# EAGLE design temprature control (EAGLE 9.6.2)
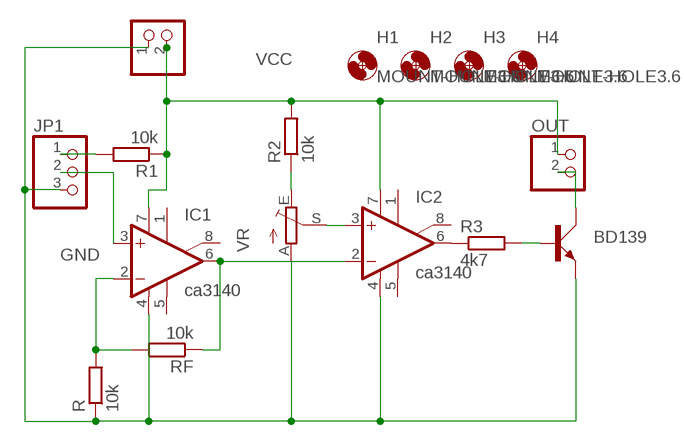
[diagram p0: schematic, sheet 1]

## Parts
H1  MOUNT-HOLE3.6  [3,6]
H2  MOUNT-HOLE3.6  [3,6]
H3  MOUNT-HOLE3.6  [3,6]
H4  MOUNT-HOLE3.6  [3,6]
IC1  ca3140  LM3080N  [DIL08]
IC2  ca3140  LM3080N  [DIL08]
JP1  PINHD-1X3  [1X03]
OUT  PINHD-1X2  [1X02]
Q1  BD139  [TO126AV]
R  10k  R-EU_0207/15  [0207/15]
R1  10k  R-EU_0207/15  [0207/15]
R2  10k  R-EU_0207/15  [0207/15]
R3  4k7  R-EU_0207/15  [0207/15]
RF  10k  R-EU_0207/15  [0207/15]
VCC  PINHD-1X2  [1X02]
VR  TRIM_EU-LI10  [LI10]

## Nets
GND: IC1.4(V-) IC2.4(V-) JP1.3 Q1.E R.1 VCC.1 VR.A
N$1: Q1.B R3.2
N$2: IC1.3(+IN) JP1.2
N$3: OUT.2 Q1.C
N$4: JP1.1 R1.2
N$5: IC1.2(-IN) R.2 RF.2
N$6: IC1.6(OUT) IC2.2(-IN) RF.1
N$7: IC2.6(OUT) R3.1
N$8: R2.1 VR.E
N$9: IC2.3(+IN) VR.S
VCC: IC1.7(V+) IC2.7(V+) OUT.1 R1.1 R2.2 VCC.2
Unconnected: IC1.1(ON1) IC1.5(OPT) IC1.8(ON2) IC2.1(ON1) IC2.5(OPT) IC2.8(ON2)

## Library data of the parts
H1-H4 = holes:MOUNT-HOLE: MOUNTING HOLE with drill center marker
IC1 IC2 = linear 2:*3080: OP AMP
JP1 = pinhead 2:PINHD-1X3: PIN HEADER
OUT VCC = pinhead 2:PINHD-1X2: PIN HEADER
Q1 = transistor-power 2:BD139: NPN TRANSISTOR
R R1-R3 RF = rcl:R-EU_: RESISTOR, European symbol; SPICEPREFIX: R
VR = pot2:TRIM_EU-: POTENTIOMETER

## Board
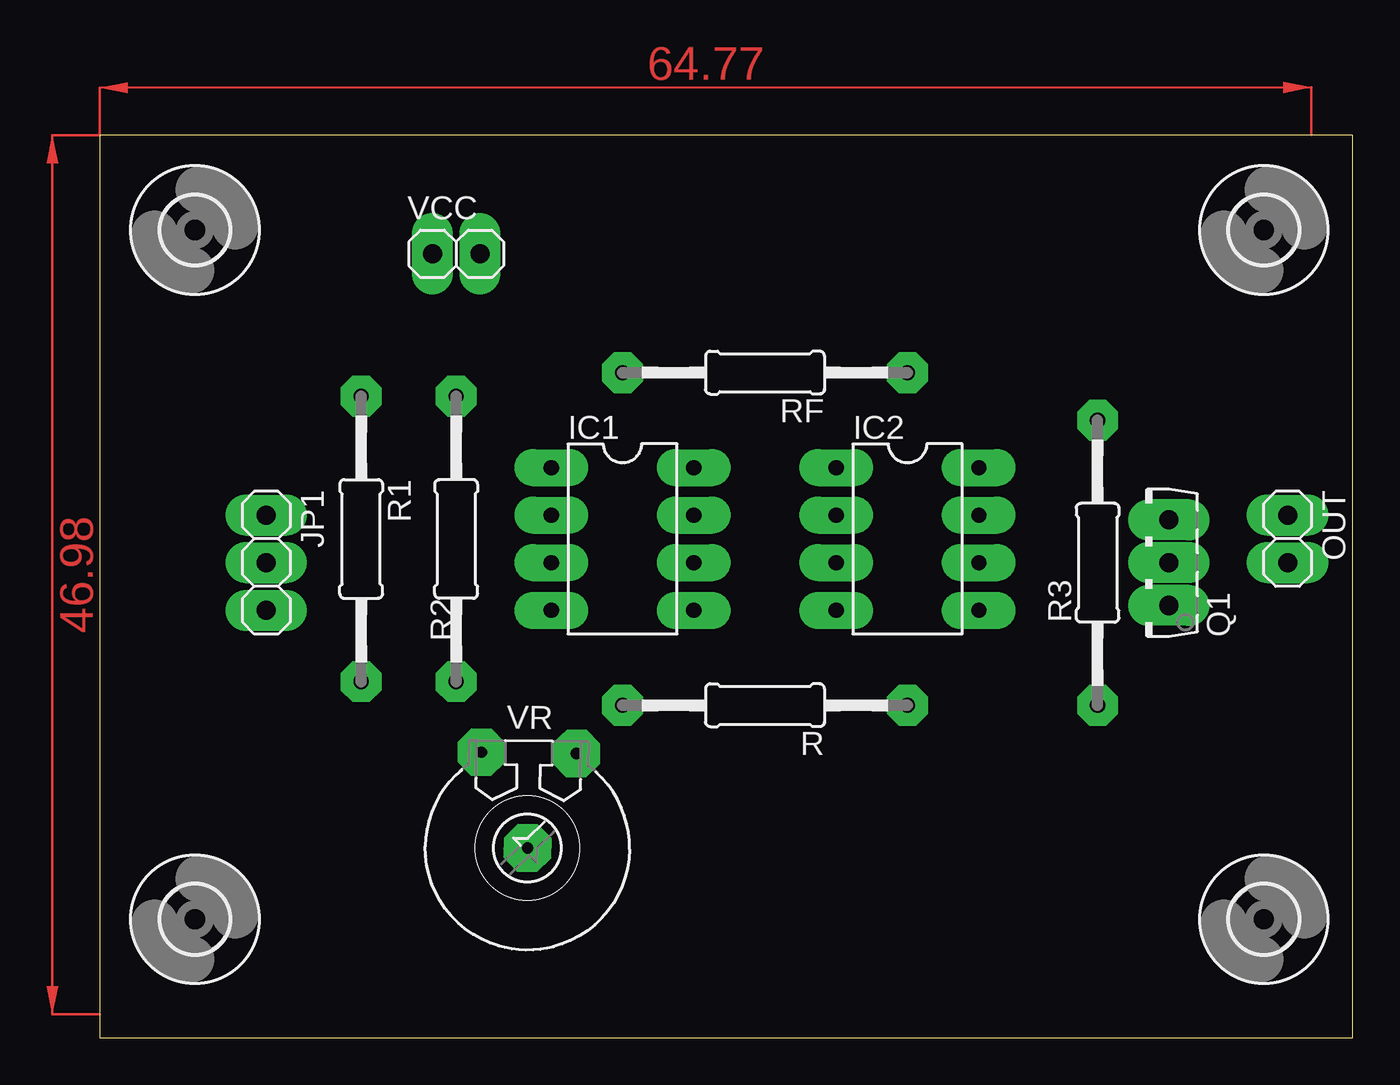
[diagram p1: board, top side]
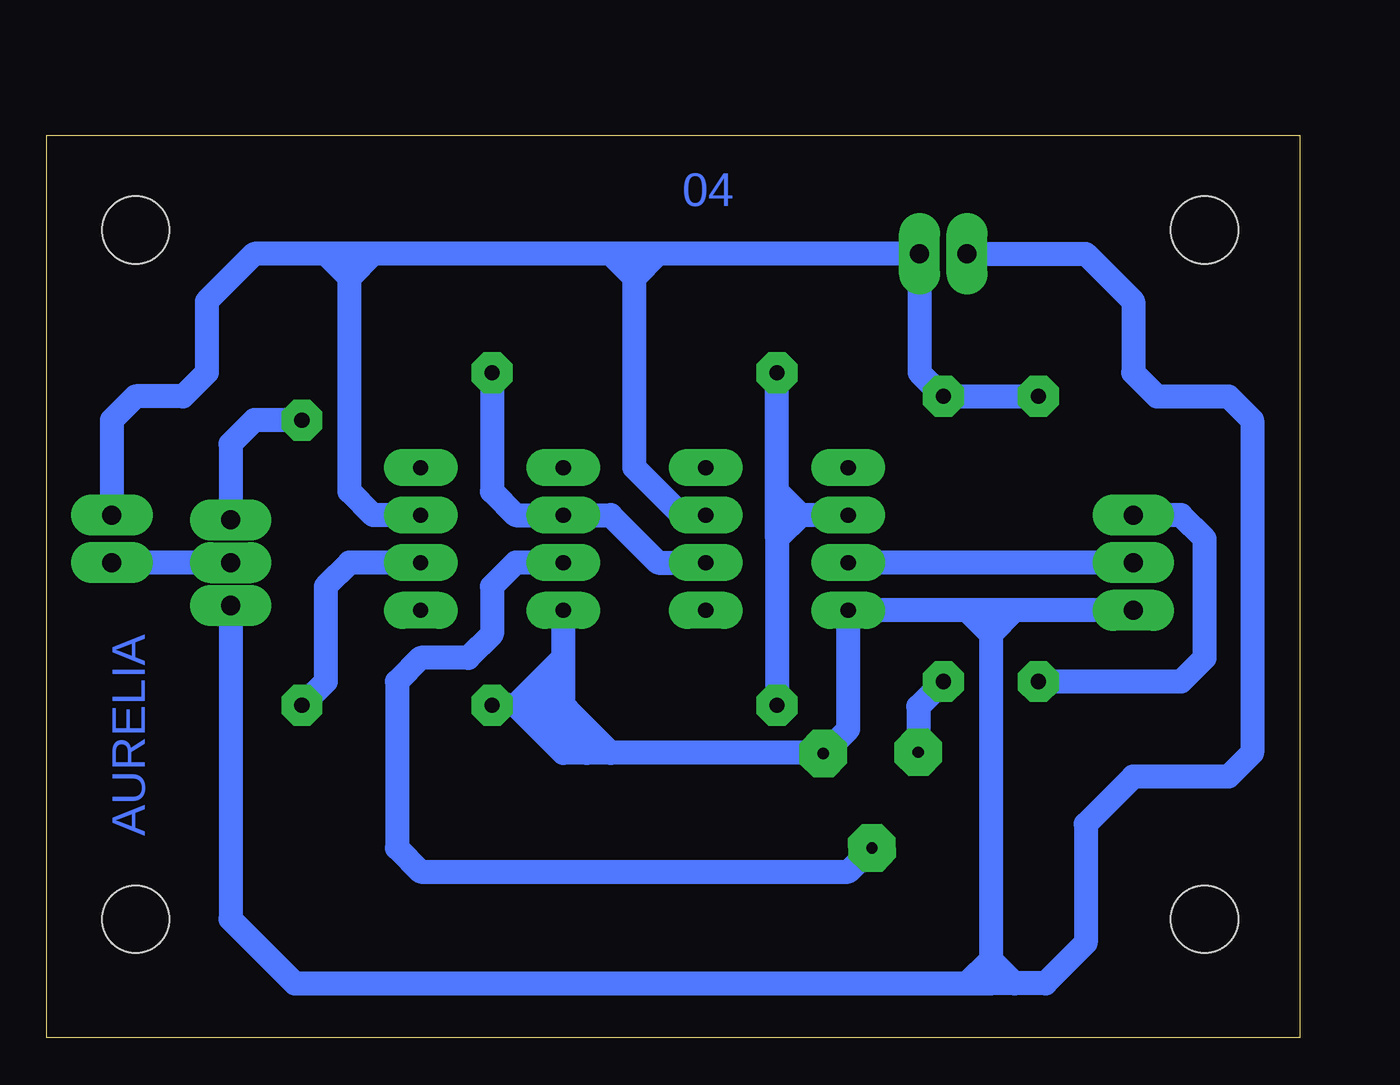
[diagram p2: board, bottom side, seen from below]

Size 66.98 x 48.25 mm. Coordinates in mm from the lower left corner, seen from the top.
Outline: 0,0 66.98,0 66.98,48.25 0,48.25 0,0
Copper layers (1*16): Top 0.035mm / dielectric 1.5mm / Bottom 0.035mm
Design rules "default *": minimum track width 6mil, minimum drill 0.35mm, track to track 6mil, track to pad 6mil, pad to pad 6mil, via to via 6mil, smd to smd 6mil, copper to edge 40mil, drill to drill 6mil, minimum pad ring 23mil, minimum via ring 8mil, stop-mask expansion 4mil, vias tented up to drill 0mil, thermal gap 10mil

### Footprints (pad centres in the part's own frame; a part is rotated, then mirrored left to right if it is on the bottom)
3,6 = hole 3.6: 0,0
DIL08 = drill 0.813 pad 1.778 long: 1 -3.81,-3.81; 2 -1.27,-3.81; 3 1.27,-3.81; 4 3.81,-3.81; 5 3.81,3.81; 6 1.27,3.81; 7 -1.27,3.81; 8 -3.81,3.81
1X03 = drill 1.016 pad 1.93 long: 1 -2.54,0; 2 0,0; 3 2.54,0
1X02 = drill 1.016 pad 1.93 long: 1 -1.27,0; 2 1.27,0
TO126AV = drill 1.016 long: B 2.286,-1.27; C 0,-1.27; E -2.286,-1.27
0207/15 = drill 0.813 pad 2.184 octagon: 1 -7.62,0; 2 7.62,0
LI10 = drill 0.6 pad 2.54 octagon: A -2.54,-5.08; E 2.54,-5.08; S 0,0

### Placement (x,y rotation side)
H1  62.23,6.35 0 top
H2  5.08,43.18 0 top
H3  5.08,6.35 0 top
H4  62.23,43.18 0 top
IC1  27.94,26.67 270 top
IC2  43.18,26.67 270 top
JP1  8.89,25.4 270 top
OUT  63.5,26.67 270 top
Q1  55.88,25.4 90 top
R  35.56,17.78 180 top
R1  13.97,26.67 270 top
R2  19.05,26.67 90 top
R3  53.34,25.4 90 top
RF  35.56,35.56 180 top
VCC  19.05,41.91 0 top
VR  22.86,10.16 179.2 top

### Tracks (layer width: path | path; a pad name or v marks a point on that pad's centre or on a via)
GND
  Bottom 1.27: 15.24,2.92 13.59,2.92 11.43,5.08 11.43,11.43 8.89,13.97 3.81,13.97 2.54,15.24 2.54,33.02 3.81,34.29 7.62,34.29 8.89,35.56 8.89,39.37 11.43,41.91 VCC.1 | 15.24,2.92 16.51,2.92 | 17.78,2.92 53.72,2.92 57.15,6.35 Q1.E | 17.78,2.92 16.51,2.92 | 39.37,19.05 40.01,18.41 | 40.01,18.41 40.64,17.78 | IC2.4 39.37,20.32 | 39.37,20.32 39.37,19.05 | JP1.3 15.24,22.86 | 15.24,22.86 16.51,22.86 | 16.51,22.86 17.78,22.86 | 17.78,22.86 IC1.4 24.13,16.51 25.44,15.2 VR.A 25.51,15.24 36.83,15.24 | 16.51,22.86 16.51,21.59 | 16.51,21.59 16.51,4.19 | 16.51,4.19 16.51,2.92 | 40.64,17.78 41.91,17.78 | 41.91,17.78 R.1 | 39.37,15.24 40.64,16.51 | 40.64,16.51 40.64,17.78 | 36.83,15.24 38.1,15.24 | 38.1,15.24 39.37,15.24 | 39.37,19.05 39.37,16.51 | 39.37,15.24 39.37,16.51 | 40.64,16.51 41.91,17.78 | 39.37,20.32 41.91,17.78 | 38.1,15.24 39.37,16.51 | 39.37,16.51 38.1,16.51 | 38.1,16.51 36.83,15.24 | 38.1,16.51 40.01,18.41 | 15.24,22.86 16.51,21.59 | 17.78,22.86 16.51,21.59 | 15.24,2.92 16.51,4.19 | 16.51,4.19 17.78,2.92
N$1
  Bottom 1.27: R3.2 55.88,33.02 57.15,31.75 Q1.B
N$2
  Bottom 1.27: JP1.2 IC1.3
N$3
  Bottom 1.27: Q1.C OUT.2
N$4
  Bottom 1.27: R1.2 6.35,19.05 5.08,20.32 5.08,26.67 6.35,27.94 JP1.1 10.16,27.94
N$5
  Bottom 1.27: IC1.2 26.67,27.94 | 27.94,26.67 27.94,29.21 | 27.94,29.21 RF.2 | 26.67,27.94 27.94,26.67 | 27.94,26.67 R.2 | 26.67,27.94 27.94,29.21
N$6
  Bottom 1.27: RF.1 43.18,29.21 41.91,27.94 IC2.2 36.83,27.94 34.29,25.4 IC1.6
N$7
  Bottom 1.27: IC2.6 50.8,25.4 52.07,24.13 52.07,19.05 R3.1
N$8
  Bottom 1.27: R2.1 20.39,17.71 VR.E
N$9
  Bottom 1.27: IC2.3 41.91,25.4 43.18,24.13 43.18,21.59 44.45,20.32 46.99,20.32 48.26,19.05 48.26,10.16 46.99,8.89 24.13,8.89 VR.S
VCC
  Bottom 1.27: 34.29,41.91 VCC.2 20.32,35.56 R2.2 R1.1 | 34.29,41.91 35.56,41.91 | 35.56,41.91 36.83,41.91 | 36.83,41.91 49.53,41.91 | 49.53,41.91 50.8,41.91 | IC1.7 33.02,27.94 35.56,30.48 35.56,40.64 | 35.56,40.64 35.56,41.91 | 50.8,40.64 50.8,41.91 | 50.8,41.91 52.07,41.91 | 52.07,41.91 55.88,41.91 58.42,39.37 58.42,35.56 59.69,34.29 62.23,34.29 63.5,33.02 OUT.1 | 34.29,41.91 35.56,40.64 | 36.83,41.91 35.56,40.64 | 49.53,41.91 50.8,40.64 | 52.07,41.91 50.8,40.64 | IC2.7 49.53,27.94 50.8,29.21 50.8,40.64
(copper drawn outside any net)
  shapes: Top area x2

### Text on the board
Bottom: 04 | AURELIA